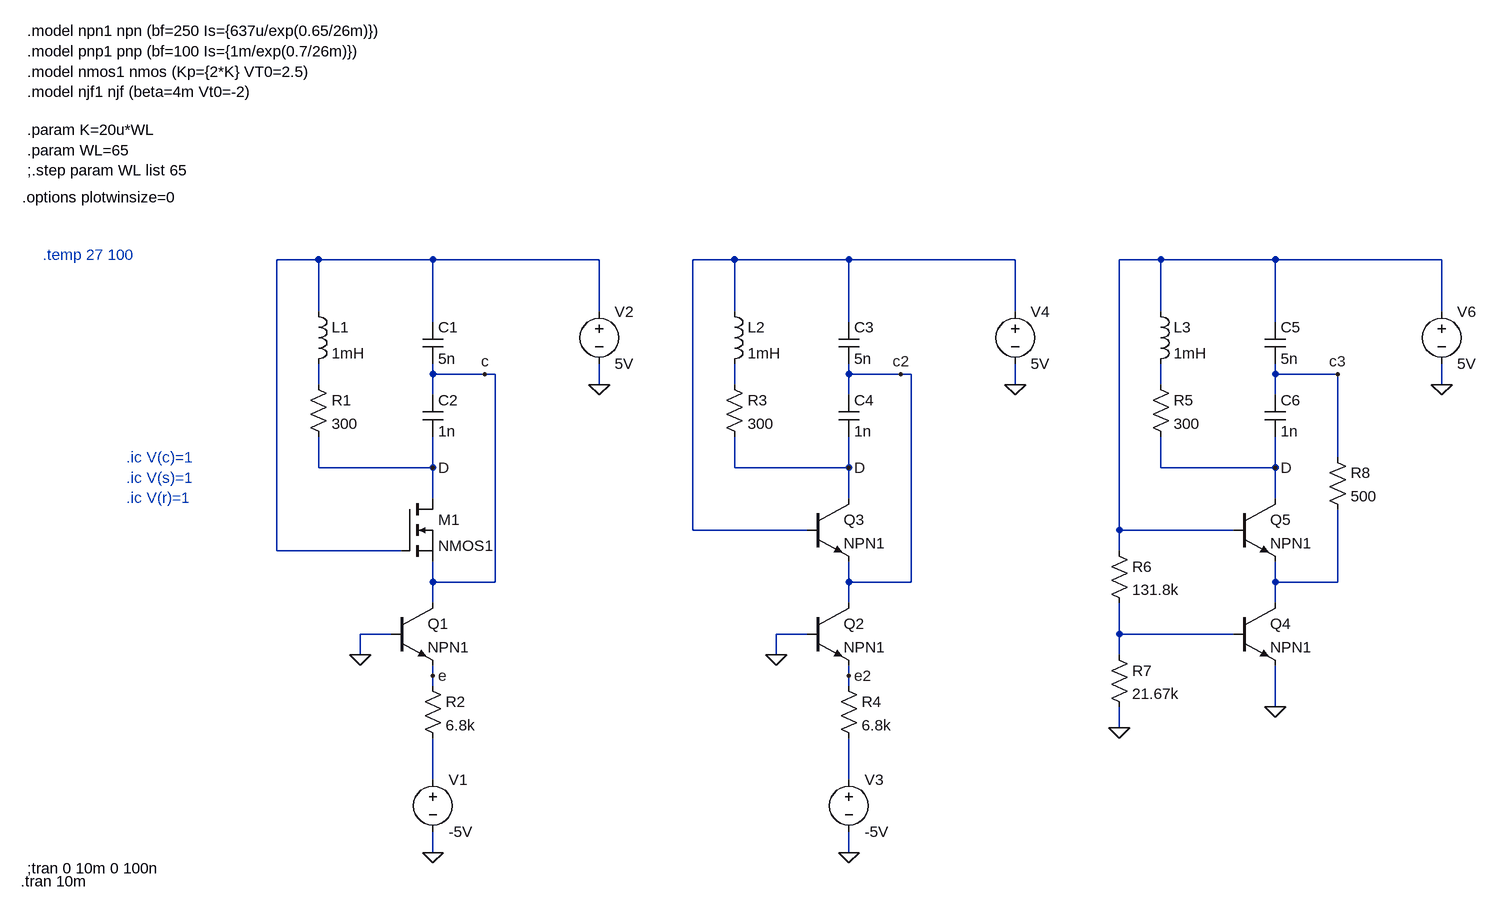
[diagram p0: schematic ss2013_collpits_nojfet.asc]
ss2013_collpits_nojfet.asc, the LTspice schematic file:
Version 4
SHEET 1 880 788
WIRE -1872 -704 -1936 -704
WIRE -1696 -704 -1872 -704
WIRE -1440 -704 -1696 -704
WIRE -1232 -704 -1296 -704
WIRE -1056 -704 -1232 -704
WIRE -800 -704 -1056 -704
WIRE -576 -704 -640 -704
WIRE -400 -704 -576 -704
WIRE -144 -704 -400 -704
WIRE -1872 -624 -1872 -704
WIRE -1440 -624 -1440 -704
WIRE -1232 -624 -1232 -704
WIRE -800 -624 -800 -704
WIRE -576 -624 -576 -704
WIRE -144 -624 -144 -704
WIRE -1696 -608 -1696 -704
WIRE -1056 -608 -1056 -704
WIRE -400 -608 -400 -704
WIRE -1696 -528 -1696 -544
WIRE -1616 -528 -1696 -528
WIRE -1600 -528 -1616 -528
WIRE -1056 -528 -1056 -544
WIRE -976 -528 -1056 -528
WIRE -960 -528 -976 -528
WIRE -400 -528 -400 -544
WIRE -304 -528 -400 -528
WIRE -1872 -512 -1872 -544
WIRE -1440 -512 -1440 -544
WIRE -1232 -512 -1232 -544
WIRE -800 -512 -800 -544
WIRE -576 -512 -576 -544
WIRE -144 -512 -144 -544
WIRE -1696 -496 -1696 -528
WIRE -1056 -496 -1056 -528
WIRE -400 -496 -400 -528
WIRE -304 -400 -304 -528
WIRE -1872 -384 -1872 -432
WIRE -1696 -384 -1696 -432
WIRE -1696 -384 -1872 -384
WIRE -1232 -384 -1232 -432
WIRE -1056 -384 -1056 -432
WIRE -1056 -384 -1232 -384
WIRE -576 -384 -576 -432
WIRE -400 -384 -400 -432
WIRE -400 -384 -576 -384
WIRE -1696 -336 -1696 -384
WIRE -1056 -336 -1056 -384
WIRE -400 -336 -400 -384
WIRE -1296 -288 -1296 -704
WIRE -1120 -288 -1296 -288
WIRE -640 -288 -640 -704
WIRE -464 -288 -640 -288
WIRE -1936 -256 -1936 -704
WIRE -1744 -256 -1936 -256
WIRE -640 -256 -640 -288
WIRE -1696 -208 -1696 -240
WIRE -1600 -208 -1600 -528
WIRE -1600 -208 -1696 -208
WIRE -1056 -208 -1056 -240
WIRE -960 -208 -960 -528
WIRE -960 -208 -1056 -208
WIRE -400 -208 -400 -240
WIRE -304 -208 -304 -320
WIRE -304 -208 -400 -208
WIRE -1696 -176 -1696 -208
WIRE -1056 -176 -1056 -208
WIRE -400 -176 -400 -208
WIRE -1760 -128 -1808 -128
WIRE -1120 -128 -1168 -128
WIRE -640 -128 -640 -176
WIRE -464 -128 -640 -128
WIRE -1808 -96 -1808 -128
WIRE -1168 -96 -1168 -128
WIRE -640 -96 -640 -128
WIRE -1696 -64 -1696 -80
WIRE -1056 -64 -1056 -80
WIRE -1696 -48 -1696 -64
WIRE -1056 -48 -1056 -64
WIRE -400 -16 -400 -80
WIRE -640 16 -640 -16
WIRE -1696 96 -1696 32
WIRE -1056 96 -1056 32
WIRE -1696 208 -1696 176
WIRE -1056 208 -1056 176
FLAG -1440 -512 0
FLAG -1696 208 0
FLAG -1808 -96 0
FLAG -1616 -528 c
FLAG -1696 -384 D
FLAG -1696 -64 e
FLAG -800 -512 0
FLAG -1056 208 0
FLAG -1168 -96 0
FLAG -976 -528 c2
FLAG -1056 -384 D
FLAG -1056 -64 e2
FLAG -144 -512 0
FLAG -400 -384 D
FLAG -304 -528 c3
FLAG -400 -16 0
FLAG -640 16 0
SYMBOL ind -1888 -640 R0
SYMATTR InstName L1
SYMATTR Value 1mH
SYMBOL res -1888 -528 R0
SYMATTR InstName R1
SYMATTR Value 300
SYMBOL cap -1712 -608 R0
SYMATTR InstName C1
SYMATTR Value 5n
SYMBOL cap -1712 -496 R0
SYMATTR InstName C2
SYMATTR Value 1n
SYMBOL nmos -1744 -336 R0
SYMATTR InstName M1
SYMATTR Value NMOS1
SYMBOL npn -1760 -176 R0
SYMATTR InstName Q1
SYMATTR Value NPN1
SYMBOL res -1712 -64 R0
SYMATTR InstName R2
SYMATTR Value 6.8k
SYMBOL voltage -1696 80 R0
WINDOW 123 0 0 Left 2
WINDOW 39 0 0 Left 2
SYMATTR InstName V1
SYMATTR Value -5V
SYMBOL voltage -1440 -640 R0
SYMATTR InstName V2
SYMATTR Value 5V
SYMBOL ind -1248 -640 R0
SYMATTR InstName L2
SYMATTR Value 1mH
SYMBOL res -1248 -528 R0
SYMATTR InstName R3
SYMATTR Value 300
SYMBOL cap -1072 -608 R0
SYMATTR InstName C3
SYMATTR Value 5n
SYMBOL cap -1072 -496 R0
SYMATTR InstName C4
SYMATTR Value 1n
SYMBOL npn -1120 -176 R0
SYMATTR InstName Q2
SYMATTR Value NPN1
SYMBOL res -1072 -64 R0
SYMATTR InstName R4
SYMATTR Value 6.8k
SYMBOL voltage -1056 80 R0
WINDOW 123 0 0 Left 2
WINDOW 39 0 0 Left 2
SYMATTR InstName V3
SYMATTR Value -5V
SYMBOL voltage -800 -640 R0
SYMATTR InstName V4
SYMATTR Value 5V
SYMBOL npn -1120 -336 R0
SYMATTR InstName Q3
SYMATTR Value NPN1
SYMBOL ind -592 -640 R0
SYMATTR InstName L3
SYMATTR Value 1mH
SYMBOL res -592 -528 R0
SYMATTR InstName R5
SYMATTR Value 300
SYMBOL cap -416 -608 R0
SYMATTR InstName C5
SYMATTR Value 5n
SYMBOL cap -416 -496 R0
SYMATTR InstName C6
SYMATTR Value 1n
SYMBOL npn -464 -176 R0
SYMATTR InstName Q4
SYMATTR Value NPN1
SYMBOL voltage -144 -640 R0
SYMATTR InstName V6
SYMATTR Value 5V
SYMBOL npn -464 -336 R0
SYMATTR InstName Q5
SYMATTR Value NPN1
SYMBOL res -656 -272 R0
SYMATTR InstName R6
SYMATTR Value 131.8k
SYMBOL res -656 -112 R0
SYMATTR InstName R7
SYMATTR Value 21.67k
SYMBOL res -320 -416 R0
SYMATTR InstName R8
SYMATTR Value 500
TEXT -2320 -1056 Left 2 !.model npn1 npn (bf=250 Is={637u/exp(0.65/26m)})\n.model pnp1 pnp (bf=100 Is={1m/exp(0.7/26m)})\n.model nmos1 nmos (Kp={2*K} VT0=2.5)\n.model njf1 njf (beta=4m Vt0=-2)
TEXT -2320 232 Left 2 !;tran 0 10m 0 100n
TEXT -2168 -400 Left 2 ;.ic V(c)=1\n.ic V(s)=1\n.ic V(r)=1
TEXT -2320 -904 Left 2 !.param K=20u*WL\n.param WL=65\n;.step param WL list 65
TEXT -2328 -800 Left 2 !.options plotwinsize=0
TEXT -2296 -712 Left 2 ;.temp 27 100
TEXT -2330 252 Left 2 !.tran 10m

The netlist it stands for:
* ss2013_collpits_nojfet.asc
L1 N001 N004 1mH
R1 N004 D 300
C1 N001 c 5n
C2 c D 1n
M1 D N001 c c NMOS1
Q1 c 0 e 0 NPN1
R2 e N009 6.8k
V1 N009 0 -5V
V2 N001 0 5V
L2 N002 N005 1mH
R3 N005 D 300
C3 N002 c2 5n
C4 c2 D 1n
Q2 c2 0 e2 0 NPN1
R4 e2 N010 6.8k
V3 N010 0 -5V
V4 N002 0 5V
Q3 D N002 c2 0 NPN1
L3 N003 N006 1mH
R5 N006 D 300
C5 N003 c3 5n
C6 c3 D 1n
Q4 N007 N008 0 0 NPN1
V6 N003 0 5V
Q5 D N003 N007 0 NPN1
R6 N003 N008 131.8k
R7 N008 0 21.67k
R8 c3 N007 500
.model NPN NPN
.model PNP PNP
.lib standard.bjt
.model NMOS NMOS
.model PMOS PMOS
.lib standard.mos
.model npn1 npn (bf=250 Is={637u/exp(0.65/26m)})
.model pnp1 pnp (bf=100 Is={1m/exp(0.7/26m)})
.model nmos1 nmos (Kp={2*K} VT0=2.5)
.model njf1 njf (beta=4m Vt0=-2)
;tran 0 10m 0 100n
* .ic V(c)=1
* .ic V(s)=1
* .ic V(r)=1
.param K=20u*WL
.param WL=65
;.step param WL list 65
.options plotwinsize=0
* .temp 27 100
.tran 10m
.backanno
.end